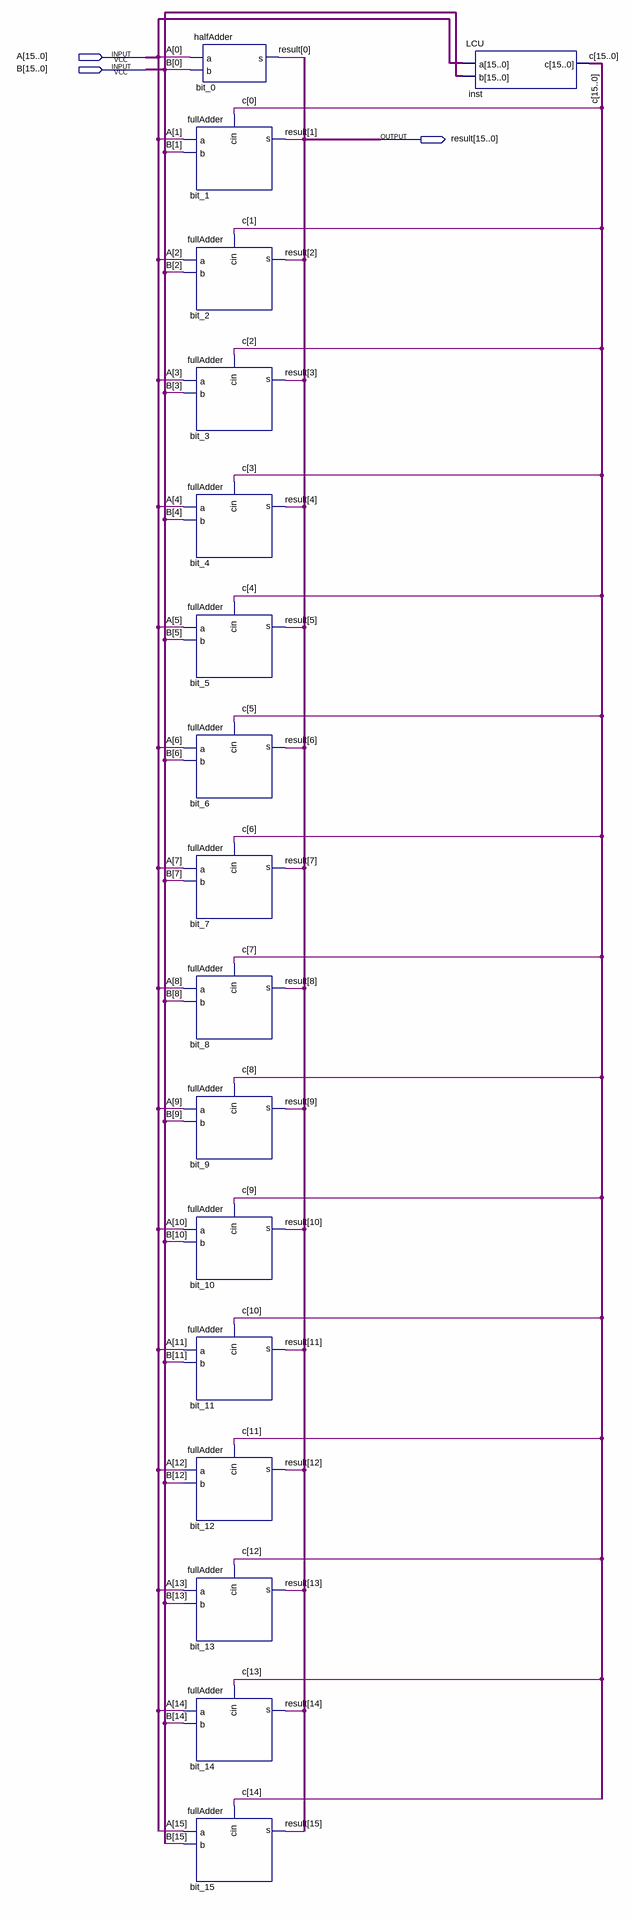
[diagram p0: schematic sheet]
// Quartus schematic adder16bit.bdf as structural Verilog: 17 symbols, 3 pins
module adder16bit (
  input  [15:0] A,
  input  [15:0] B,
  output [15:0] result
);

  wire [15:0] c;

  halfAdder bit_0 (.a(A[0]), .b(B[0]), .s(result[0]));
  fullAdder bit_1 (.a(A[1]), .b(B[1]), .cin(c[0]), .s(result[1]));
  fullAdder bit_2 (.a(A[2]), .b(B[2]), .cin(c[1]), .s(result[2]));
  fullAdder bit_3 (.a(A[3]), .b(B[3]), .cin(c[2]), .s(result[3]));
  fullAdder bit_4 (.a(A[4]), .b(B[4]), .cin(c[3]), .s(result[4]));
  fullAdder bit_5 (.a(A[5]), .b(B[5]), .cin(c[4]), .s(result[5]));
  fullAdder bit_6 (.a(A[6]), .b(B[6]), .cin(c[5]), .s(result[6]));
  fullAdder bit_7 (.a(A[7]), .b(B[7]), .cin(c[6]), .s(result[7]));
  fullAdder bit_8 (.a(A[8]), .b(B[8]), .cin(c[7]), .s(result[8]));
  fullAdder bit_9 (.a(A[9]), .b(B[9]), .cin(c[8]), .s(result[9]));
  fullAdder bit_10 (.a(A[10]), .b(B[10]), .cin(c[9]), .s(result[10]));
  fullAdder bit_11 (.a(A[11]), .b(B[11]), .cin(c[10]), .s(result[11]));
  fullAdder bit_12 (.a(A[12]), .b(B[12]), .cin(c[11]), .s(result[12]));
  fullAdder bit_13 (.a(A[13]), .b(B[13]), .cin(c[12]), .s(result[13]));
  fullAdder bit_14 (.a(A[14]), .b(B[14]), .cin(c[13]), .s(result[14]));
  fullAdder bit_15 (.a(A[15]), .b(B[15]), .cin(c[14]), .s(result[15]));
  LCU inst (.a(A), .b(B), .c(c));
endmodule
